# Altium schematic sheet 32_PP0_NC.SchDoc
size 419 x 296 mm; Author: Serbinov O.A.; CompanyName: ELSICOM; DrawnBy: Serbinov O.A.; Engineer: Serbinov O.A.; Organization: Elsicom; Address1: Kirova avenue, 58; Address2: Tomsk; Address3: Russia 634012; DocumentNumber: 33; SheetNumber: 33; SheetTotal: 44; ProjectName: 48_PORTS
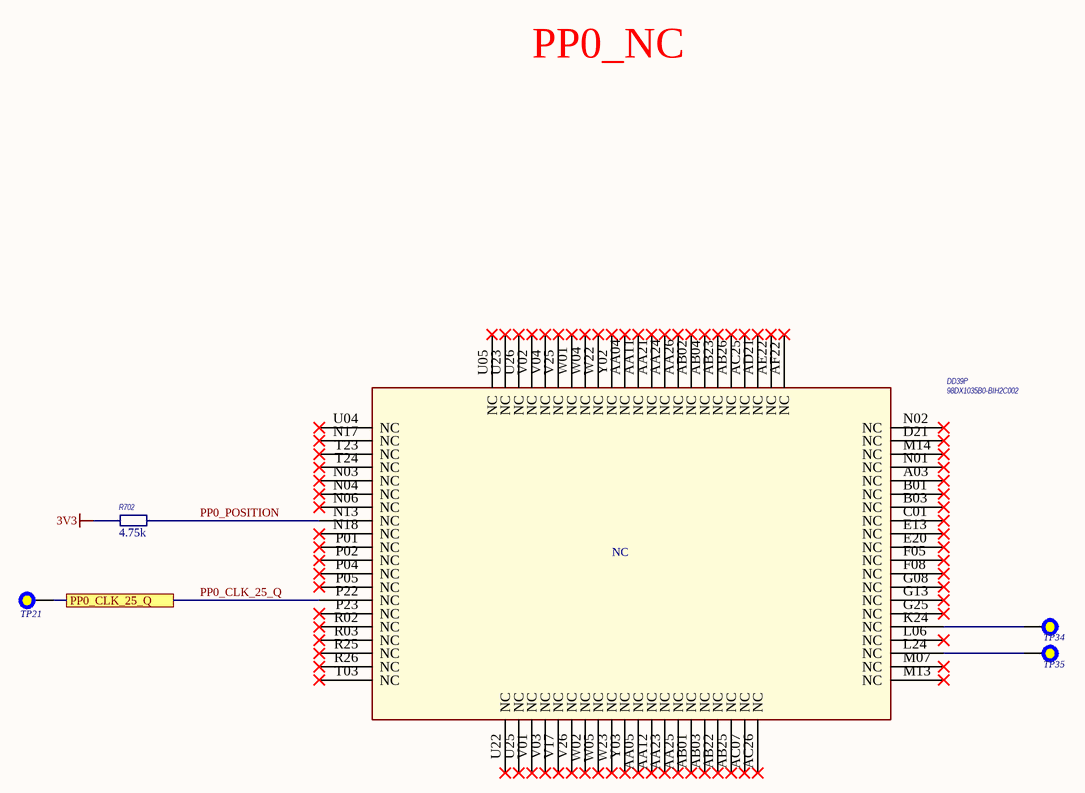
[diagram p0: 32_PP0_NC.SchDoc]

## Parts
DD39  98DX1035B0-BIH2C002  [HSBGA617_27X27_1MM]  (part P of 16)
R702  Resistance (Ohms): 4.75k  [R0402_IPC High Density]  (hidden comment: ERJ-2RKF4751X)
TP21  Test Point 0.5mm pad  [Test Point 0.5mm]  (value not drawn)  (no BOM)
TP34  Test Point 0.5mm pad  [Test Point 0.5mm]  (value not drawn)  (no BOM)
TP35  Test Point 0.5mm pad  [Test Point 0.5mm]  (value not drawn)  (no BOM)

## Ports
PP0_CLK_25_Q

## Nets
3V3: R702.1
PP0_CLK_25_Q: DD39.P22(NC) TP21.1 ; port PP0_CLK_25_Q
PP0_POSITION: DD39.N13(NC) R702.2
NetDD39_K24: DD39.K24(NC) TP34.1
NetDD39_L24: DD39.L24(NC) TP35.1

Not connected (* = marked no-connect by the designer): DD39 A03(NC)* AA04(NC)* AA05(NC)* AA11(NC)* AA12(NC)* AA21(NC)* AA23(NC)* AA24(NC)* AA25(NC)* AA26(NC)* AB01(NC)* AB02(NC)* AB03(NC)* AB04(NC)* AB22(NC)* AB23(NC)* AB25(NC)* AB26(NC)* AC07(NC)* AC25(NC)* AC26(NC)* AD21(NC)* AE22(NC)* AF22(NC)* B01(NC)* B03(NC)* C01(NC)* D21(NC)* E13(NC)* E20(NC)* F05(NC)* F08(NC)* G08(NC)* G13(NC)* G25(NC)* L06(NC)* M07(NC)* M13(NC)* M14(NC)* N01(NC)* N02(NC)* N03(NC)* N04(NC)* N06(NC)* N17(NC)* N18(NC)* P01(NC)* P02(NC)* P04(NC)* P05(NC)* P23(NC)* R02(NC)* R03(NC)* R25(NC)* R26(NC)* T03(NC)* T23(NC)* T24(NC)* U04(NC)* U05(NC)* U22(NC)* U23(NC)* U25(NC)* U26(NC)* V01(NC)* V02(NC)* V03(NC)* V04(NC)* V17(NC)* V25(NC)* V26(NC)* W01(NC)* W02(NC)* W04(NC)* W05(NC)* W22(NC)* W23(NC)* Y02(NC)* Y03(NC)*

## Notes on the sheet
- PP0_NC
- A3
- SIZE
- PROJECT
- SHEET
- OF
- Engineer: Oleg Serbinov

## Library data of the parts
DD39 = 98DX1035A1-BIH2C002: IC 24-PORT FE  4-PORT 2.5GE L2 ENTRY-LEVEL, CPU; Customer Part Number: Микросхема, 98DX1035B0-BIH2C002, IC 24-PORT FE 4-PORT 2.5GE L2 ENTRY-LEVEL, HSBGA617SBGA617; Manufacturer: Marvell Technology Group; Manufacturer Part Number: 98DX1035B0-BIH2C002
R702 = ERJ-2RKF4751X: R0402, 4.75k 1%; Manufacturer: Panasonic; Rpart number: RC0402FR-074K75L ; RC1005F4751CS ; RMCF0402FT4K75 ; CRCW04024K75FKED ; TRR01MZPF4751; Rmanufacturer: Yageo  Samsung  Stackpole Electronics  Rohm Semiconductor  Vishay Dale; Customer Part Number: Резистор, 4K75, 0402, 1%; Temperature Coefficient: ±100ppm/°C; Power (Watts): 0.1W, 1/10W; Analogs: any suitable; Tolerance: ±1%; Packaging: Cut Tape (CT); Package / Case: 0402 (1005 Metric); Category: Resistors; Manufacturer Part Number: ERJ-2RKF4751X; Supplier Part Number: P4.75KLCT-ND; RoHS: RoHS Compliant; Supplier: Digi-Key; ComponentLink1URL: http://industrial.panasonic.com/www-cgi/jvcr13pz.cgi?E+PZ+3+AOA0002+ERJ2RKF4751X+7+WW; ComponentLink1Description: http://industrial.panasonic.com/www-cgi/jvcr13pz.cgi?E+PZ+3+AOA0002+ERJ2RKF4751X+7+WW; Features: -; Composition: Thick Film; Height: 0.016" (0.40mm); Number of Terminations: 2; Supplier Device Package: 0402; Size / Dimension: 0.039" L x 0.020" W (1.00mm x 0.50mm)